# Altium schematic sheet RasPagerC9000_smart_prototyping.SchDoc
size A4; PageSetup: Record=PageOptions|CenterHorizontal=True|CenterVertical=True|PrintScale=1.00|XCorrection=1.00|YCorrection=1.00|PrintKind=0|BorderSize=5000000|LeftOffset=0|BottomOffset=0|Orientation=2|PaperLength=1000|PaperWidth=1000|Scale=100|PaperSource=7|PrintQuality=-3|MediaType=1|DitherType=10|PrintScaleMode=1|PaperKind=A4|PaperIndex=9
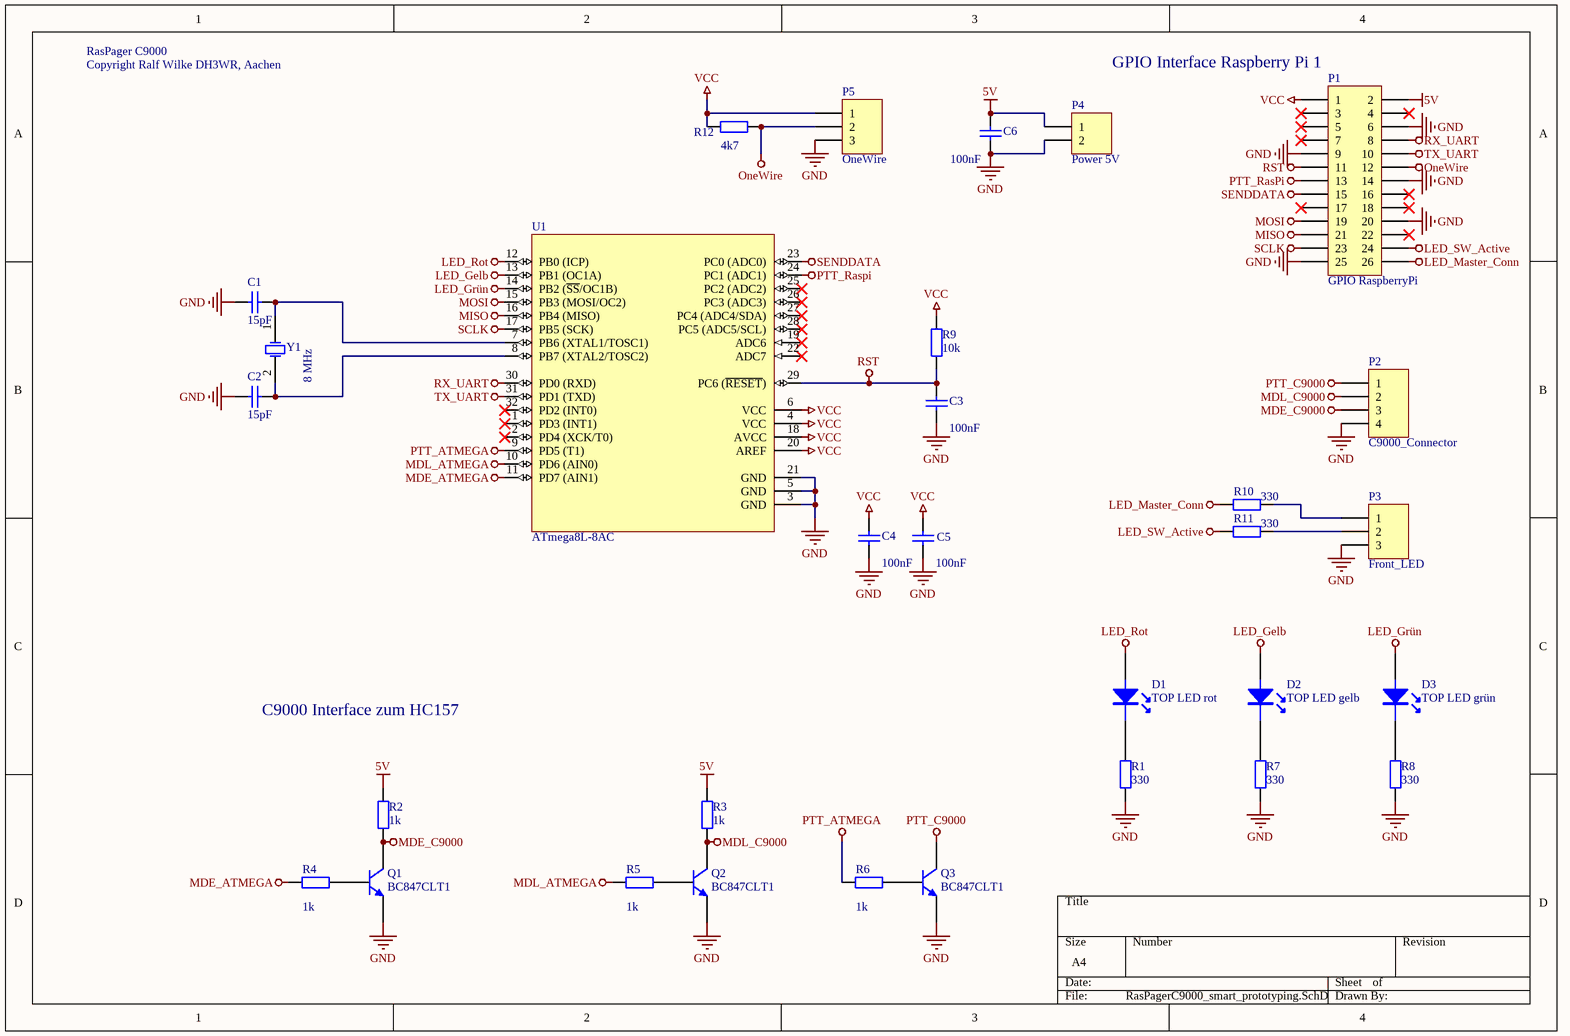
[diagram p0: RasPagerC9000_smart_prototyping.SchDoc]

## Parts
C1  value 15pF  [0805]  (hidden comment: Cap)
C2  value 15pF  [0805]  (hidden comment: Cap)
C3  value 100nF  [0805]  (hidden comment: Cap)
C4  value 100nF  [0805]  (hidden comment: Cap)
C5  value 100nF  [0805]  (hidden comment: Cap)
C6  value 100nF  [0805]  (hidden comment: Cap)
D1  TOP LED rot  [0805]
D2  TOP LED gelb  [0805]
D3  TOP LED grün  [0805]
P1  GPIO RaspberryPi  [HDR2X13]
P2  C9000_Connector  [HDR1X4]
P3  Front_LED  [HDR1X3]
P4  Power 5V  [HDR1X2]
P5  OneWire  [HDR1X3]
Q1  BC847CLT1  [SOT-23]
Q2  BC847CLT1  [SOT-23]
Q3  BC847CLT1  [SOT-23]
R1  value 330  [0805]
R2  value 1k  [0805]
R3  value 1k  [0805]
R4  value 1k  [0805]
R5  value 1k  [0805]
R6  value 1k  [0805]
R7  value 330  [0805]
R8  value 330  [0805]
R9  value 10k  [0805]
R10  value 330  [0805]
R11  value 330  [0805]
R12  value 4k7  [0805]
U1  ATmega8L-8AC  [32A_N]
Y1  8 MHz  [HC49/4H SMX]

## Nets
5V: C6.2 P1.2 P4.1 R2.2 R3.2
GND: C1.1 C2.1 C3.1 C4.1 C5.1 C6.1 P1.6 P1.9 P1.14 P1.20 P1.25 P2.4 P3.3 P4.2 P5.3 Q1.2(E) Q2.2(E) Q3.2(E) R1.1 R7.1 R8.1 U1.3(GND) U1.5(GND) U1.21(GND)
LED_Gelb: D2.1 U1.13(PB1_(OC1A))
LED_Grün: D3.1 U1.14(PB2_(~{SS}/OC1B))
LED_Master_Conn: P1.26 R10.1
LED_Rot: D1.1 U1.12(PB0_(ICP))
LED_SW_Active: P1.24 R11.2
MDE_ATMEGA: R4.1 U1.11(PD7_(AIN1))
MDE_C9000: P2.3 Q1.3(C) R2.1
MDL_ATMEGA: R5.1 U1.10(PD6_(AIN0))
MDL_C9000: P2.2 Q2.3(C) R3.1
MISO: P1.21 U1.16(PB4_(MISO))
MOSI: P1.19 U1.15(PB3_(MOSI/OC2))
OneWire: P1.12 P5.2 R12.1
PTT_ATMEGA: R6.1 U1.9(PD5_(T1))
PTT_C9000: P2.1 Q3.3(C)
PTT_RasPi: P1.13 U1.24(PC1_(ADC1))
RST: C3.2 P1.11 R9.1 U1.29(PC6_(~{RESET}))
RX_UART: P1.8 U1.30(PD0_(RXD))
SCLK: P1.23 U1.17(PB5_(SCK))
SENDDATA: P1.15 U1.23(PC0_(ADC0))
TX_UART: P1.10 U1.31(PD1_(TXD))
VCC: C4.2 C5.2 P1.1 P5.1 R9.2 R12.2 U1.4(VCC) U1.6(VCC) U1.18(AVCC) U1.20(AREF)
NetC1_2: C1.2 U1.7(PB6_(XTAL1/TOSC1)) Y1.1(OSC1)
NetC2_2: C2.2 U1.8(PB7_(XTAL2/TOSC2)) Y1.2(OSC2)
NetD1_2: D1.2 R1.2
NetD2_2: D2.2 R7.2
NetD3_2: D3.2 R8.2
NetP3_1: P3.1 R10.2
NetP3_2: P3.2 R11.1
NetQ1_1: Q1.1(B) R4.2
NetQ2_1: Q2.1(B) R5.2
NetQ3_1: Q3.1(B) R6.2

Not connected (* = marked no-connect by the designer): P1 3* 4* 5* 7* 16* 17* 18* 22*; U1 1(PD3_(INT1))* 2(PD4_(XCK/T0))* 19(ADC6)* 22(ADC7)* 25(PC2_(ADC2))* 26(PC3_(ADC3))* 27(PC4_(ADC4/SDA))* 28(PC5_(ADC5/SCL))* 32(PD2_(INT0))*

## Notes on the sheet
- RasPager C9000
- Copyright Ralf Wilke DH3WR, Aachen
- (near P1) GPIO Interface Raspberry Pi 1
- C9000 Interface zum HC157

## Library data of the parts
C1-C6 = Cap: Capacitor; Published: 8-Jun-2000; LatestRevisionDate: 17-Jul-2002; LatestRevisionNote: Re-released for DXP Platform.; PackageReference: RAD-0.3; Publisher: Altium Limited
D1-D3 = LED_2
P1 = Header 13X2: Header, 13-Pin, Dual row; LatestRevisionDate: 17-Jul-2002; LatestRevisionNote: Re-released for DXP Platform.; Publisher: Altium Limited
P2 = Header 4: Header, 4-Pin; LatestRevisionDate: 17-Jul-2002; LatestRevisionNote: Re-released for DXP Platform.; Publisher: Altium Limited
P3 P5 = Header 3: Header, 3-Pin; LatestRevisionDate: 17-Jul-2002; LatestRevisionNote: Re-released for DXP Platform.; Publisher: Altium Limited
P4 = Header 2: Header, 2-Pin; LatestRevisionDate: 17-Jul-2002; LatestRevisionNote: Re-released for DXP Platform.; Publisher: Altium Limited
Q1-Q3 = BC847CLT1: General Purpose Transistor NPN Silicon; PackageDocument: 1997; Published: 29-Sep-2000; LatestRevisionDate: 17-Jul-2002; LatestRevisionNote: Re-released for DXP Platform.; DatasheetDocument: 1997; PackageReference: 318-08; Publisher: Altium Limited; ComponentLink1Description: Manufacturer Link; ComponentLink1URL: http://www.onsemi.com/site/products/landing?taxonomyID=194; ComponentLink2Description: Datasheet; ComponentLink2URL: http://www.onsemi.com/pub/Collateral/BC846ALT1-D.PDF
R1-R12 = Res2: Resistor; Published: 8-Jun-2000; LatestRevisionDate: 17-Jul-2002; LatestRevisionNote: Re-released for DXP Platform.; PackageReference: AXIAL-0.4; Publisher: Altium Limited
U1 = ATmega8L-8AC: 8-Bit AVR Microcontroller with 8K Bytes of In-System Programmable Flash Memory; Published: 17-Sep-2003; LatestRevisionDate: 16-Oct-2006; LatestRevisionNote: IPC-7351 Footprint Added.; DatasheetVersion: 2486H-AVR-09/02; PackageVersion: revB, Oct-2001; PackageReference: 32A; Publisher: Altium Limited; PackageDescription: 32-Lead, 7x7x1.0 mm Body, 0.8mm Lead Pitch, Thin Profile Plastic Quad Flat Package (TQFP); Supplier 1: Digi-Key; Supplier Part Number 1: ATMEGA8L-8AC-ND; Supplier 2: Mouser; Supplier Part Number 2: 556-ATMEGA8L-8AC; Code_JEDEC: MS-026-ABA; ComponentLink1Description: Datasheet; ComponentLink1URL: http://www.atmel.com/dyn/resources/prod_documents/doc2486.pdf; ComponentLink2Description: Atmel.com Home; ComponentLink2URL: http://www.atmel.com
Y1 = XTAL: Crystal Oscillator; Published: 8-Jun-2000; LatestRevisionDate: 17-Jul-2002; LatestRevisionNote: Re-released for DXP Platform.; PackageReference: R38; Publisher: Altium Limited